# Altium schematic sheet Power_Neg.SchDoc
size A4; DocumentNumber: 3; SheetNumber: 3; SheetTotal: 11
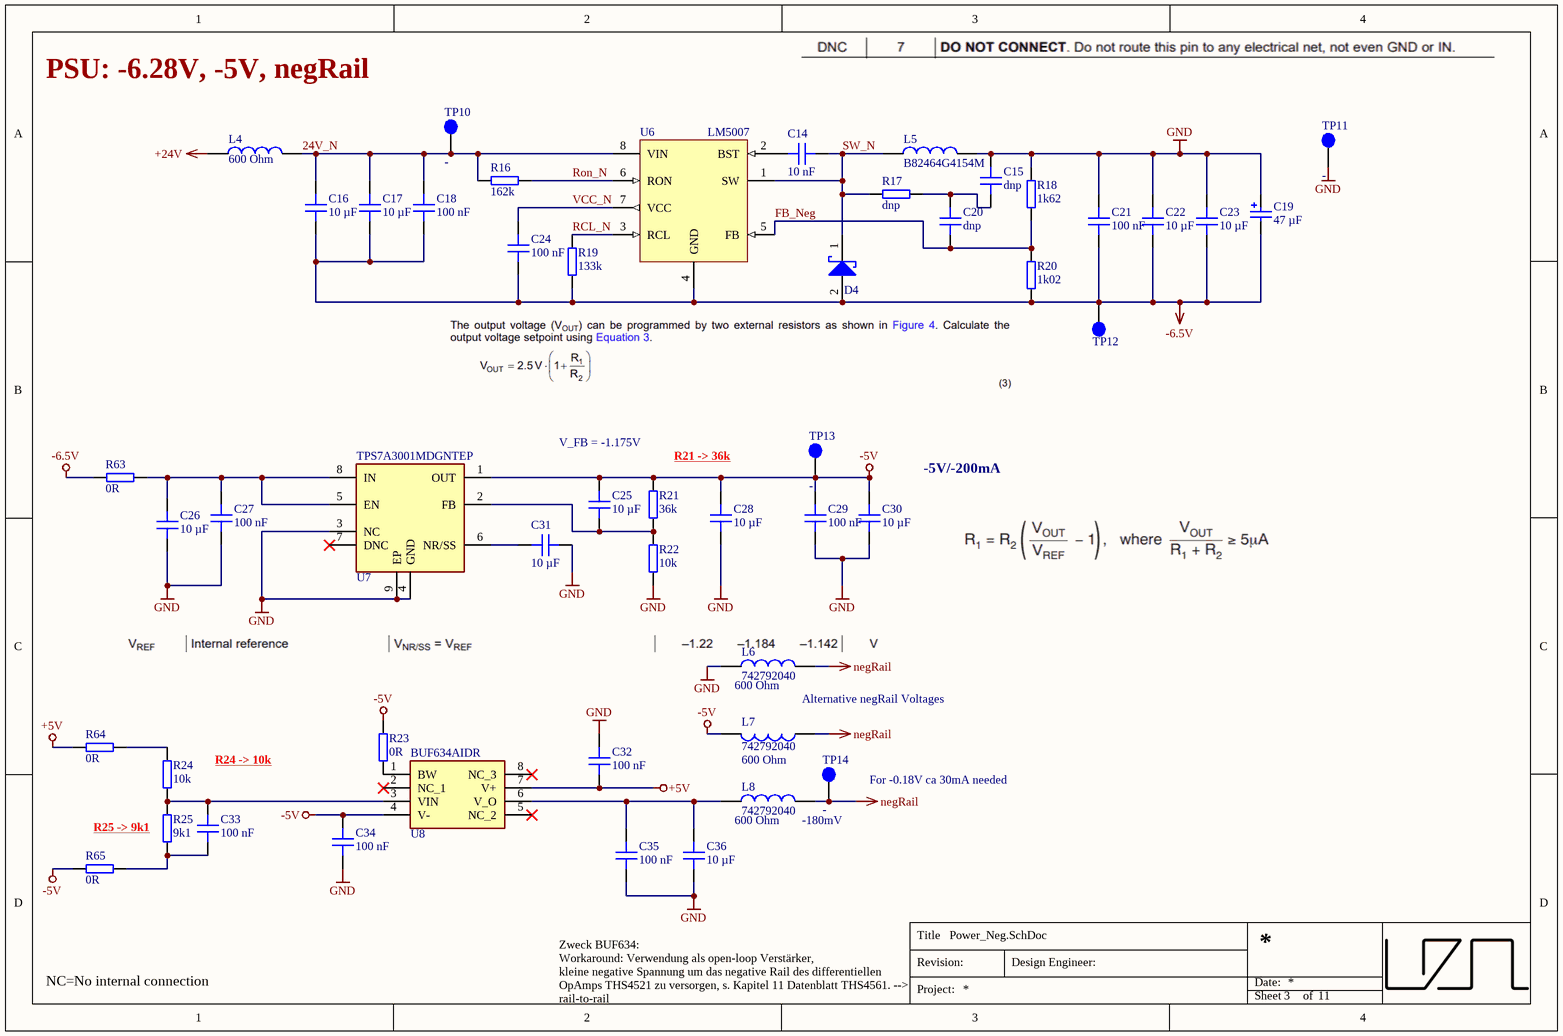
[diagram p0: Power_Neg.SchDoc]

## Parts
C14  10 nF  [C_0603]
C15  dnp  [C_1206]
C16  10 µF  [C_1206]
C17  10 µF  [C_1206]
C18  100 nF  [C_0603]
C19  47 µF  [WCAP-ASLI_5x5.5]
C20  dnp  [C_1206]
C21  100 nF  [C_0603]
C22  10 µF  [C_1206]
C23  10 µF  [C_1206]
C24  100 nF  [C_0603]
C25  10 µF  [C_1206]
C26  10 µF  [C_1206]
C27  100 nF  [C_0603]
C28  10 µF  [C_1206]
C29  100 nF  [C_0603]
C30  10 µF  [C_1206]
C31  10 µF  [C_1206]
C32  100 nF  [C_0603]
C33  100 nF  [C_0603]
C34  100 nF  [C_0603]
C35  100 nF  [C_0603]
C36  10 µF  [C_1206]
D4  BYS12-90-E3/TR3  [DIOM4227X23N]  (value not drawn)
L4  value 600 Ohm  [WE-CBF_0805_High Current]  (hidden comment: 742792040)
L5  B82464G4154M  [SMT_inductor_1050]
L6  742792040  value 600 Ohm  [WE-CBF_0805_High Current]
L7  742792040  value 600 Ohm  [WE-CBF_0805_High Current]
L8  742792040  value 600 Ohm  [WE-CBF_0805_High Current]
R16  162k  [RES 0603_1608]
R17  dnp  [RES 0603_1608]
R18  1k62  [RES 0603_1608]
R19  133k  [RES 0603_1608]
R20  1k02  [RES 0603_1608]
R21  36k  [RES 0603_1608]
R22  10k  [RES 0603_1608]
R23  0R  [RES 0603_1608]
R24  10k  [RES 0603_1608]
R25  9k1  [RES 0603_1608]
R63  0R  [RES 0603_1608]
R64  0R  [RES 0603_1608]
R65  0R  [RES 0603_1608]
TP10  -  [TP_1mm]
TP11  -  [TP_1mm]
TP12  -  [TP_1mm]  (value not drawn)
TP13  -  [TP_1mm]
TP14  -  [TP_1mm]
U6  LM5007MM/NOPB  [TSOP65P490X110-8N]  (value not drawn)
U7  TPS7A3001MDGNTEP  [SOP65P490X110-9N]
U8  BUF634AIDR  [SOIC127P600X175-8N]

## Nets
+5V: C32.1 R64.1 U8.7(V+)
+24V: L4.1
-5V: C25.2 C28.2 C29.2 C30.2 C34.2 L7.2 R21.2 R23.2 R65.1 TP13.1 U7.1(OUT) U8.4(V-)
-6.5V: C16.1 C17.1 C18.1 C19.2(N) C21.1 C22.1 C23.1 C24.1 D4.2(A) R19.1 R20.1 R63.1 TP12.1 U6.4(GND)
GND: C15.2 C19.1(P) C21.2 C22.2 C23.2 C26.1 C27.1 C28.1 C29.1 C30.1 C31.1 C32.2 C34.1 C35.1 C36.1 L5.2 L6.1 R18.2 R22.1 TP11.1 U7.3(NC) U7.4(GND) U7.9(EP)
negRail: L6.2 L7.1 L8.2 TP14.1
24V_N: C16.2 C17.2 C18.2 L4.2 R16.1 TP10.1 U6.8(VIN)
FB_Neg: C20.1 R18.1 R20.2 U6.5(FB)
RCL_N: R19.2 U6.3(RCL)
Ron_N: R16.2 U6.6(RON)
SW_N: C14.2 D4.1(K) L5.1 R17.1 U6.1(SW)
VCC_N: C24.2 U6.7(VCC)
NetC14_1: C14.1 U6.2(BST)
NetC15_1: C15.1 C20.2 R17.2
NetC25_1: C25.1 R21.1 R22.2 U7.2(FB)
NetC26_2: C26.2 C27.2 R63.2 U7.5(EN) U7.8(IN)
NetC31_2: C31.2 U7.6(NR/SS)
NetC33_1: C33.1 R25.1 R65.2
NetC33_2: C33.2 R24.1 R25.2 U8.3(VIN)
NetC35_2: C35.2 C36.2 L8.1 U8.6(V_O)
NetR23_1: R23.1 U8.1(BW)
NetR24_2: R24.2 R64.2

Not connected (* = marked no-connect by the designer): U7 7(DNC)*; U8 2(NC_1)* 5(NC_2)* 8(NC_3)*

## Notes on the sheet
- PSU: -6.28V, -5V, negRail
- V_FB = -1.175V
- R21 -> 36k
- -5V/-200mA
- Alternative negRail Voltages
- R24 -> 10k
- (near TP14) For -0.18V ca 30mA needed
- (near R25) R25 -> 9k1
- (near L8) -180mV
- NC=No internal connection
- Zweck BUF634:
  Workaround: Verwendung als open-loop Verstärker,
  kleine negative Spannung um das negative Rail des differentiellen OpAmps THS4521 zu versorgen, s. Kapitel 11 Datenblatt THS4561. --> rail-to-rail
- Title
- Revision:
- Design Engineer:
- Date:
- Project:
- Sheet
- of

## Library data of the parts
C14 = 885012206065: Capacitor 0603, 25 VDC, 10 nF, X7R; Manufacturer: Wurth Elektronik; Tolerance: 10 %; Voltage Rating: 25 VDC; Created from: MGremer; Manufacturer Part Number: 885012206065; PartID: 53; Created On: 20.12.2020 13:54:13; ComponentLink1Description: Datasheet; ComponentLink1URL: https://www.mouser.de/datasheet/2/445/885012206065-1727544.pdf; Component Type: Capacitor 0603; Device Package: 0603; Last Updated: 20.12.2020 16:43:29; Mounting Type: SMD; Operating Temperature: -55 - 125°C; Series: WCAP-CSGP; Supplier 1: Mouser; Supplier Part Number 1: 710-885012206065; Type: Capacitor; Value: 10 nF; Live Cycle Status: 1; Stock number: not stored
C15 C20 = GRM3195C1H273JA01D: Capacitor 1206, 50 VDC, 0.027 µF, C0G; Manufacturer: Murata Electronics; Tolerance: 5 %; Voltage Rating: 50 VDC; Created from: MGremer; Manufacturer Part Number: GRM3195C1H273JA01D; PartID: 51; Created On: 20.12.2020 13:54:13; ComponentLink1Description: Datasheet; ComponentLink1URL: https://www.mouser.de/datasheet/2/281/murata_03052018_GRM_Series_1-1310166.pdf; Component Type: Capacitor 1206; Device Package: 1206; Last Updated: 18.01.2021 14:28:15; Mounting Type: SMD; Operating Temperature: -55 - 125°C; Series: GRM; Supplier 1: Mouser; Supplier Part Number 1: 81-GRM315C1H273JA01D; Type: Capacitor; Value: 0.027 µF; Live Cycle Status: 1; Stock number: not stored
C16 C17 C22 C23 C25 C26 C28 C30 C31 C36 = GRT31CR61H106KE01L: Capacitor 1206, 50 VDC, 10 µF, X5R; Manufacturer: Murata Electronics; Tolerance: 10 %; Voltage Rating: 50 VDC; Created from: MGremer; Manufacturer Part Number: GRT31CR61H106KE01L; PartID: 65; Created On: 20.12.2020 13:54:13; ComponentLink1Description: Datasheet; ComponentLink1URL: https://www.mouser.de/datasheet/2/281/1/GRT31CR61H106KE01_01-1989724.pdf; Component Type: Capacitor 1206; Device Package: 1206; Last Updated: 20.12.2020 16:34:30; Mounting Type: SMD; Operating Temperature: -55 - 85°C; Series: GRT; Supplier 1: Mouser; Supplier Part Number 1: 81-GRT31CR61H106KE1L; Type: Capacitor; Value: 10 µF; Live Cycle Status: 1; Stock number: Labor SMD Container
C18 C21 C24 C27 C29 C32-C35 = C0603C104K9PACTU: Capacitor 0603, 6.3 VDC, 100 nF, X5R; Manufacturer: KEMET; Tolerance: 10 %; Voltage Rating: 6.3 VDC; Created from: MGremer; Manufacturer Part Number: C0603C104K9PACTU; PartID: 70; Created On: 20.12.2020 13:54:13; ComponentLink1Description: Datasheet; ComponentLink1URL: https://www.mouser.de/datasheet/2/212/KEM_C1006_X5R_SMD-1103249.pdf; Component Type: Capacitor 0603; Device Package: 0603; Last Updated: 20.01.2021 13:57:36; Mounting Type: SMD; Operating Temperature: -55 - 85°C; Series: SMD Comm X5R; Supplier 1: Mouser; Supplier Part Number 1: 80-C0603C104K9P; Type: Capacitor; Value: 100 nF; Live Cycle Status: 1; Stock number: not stored
C19 = 865080242004: Capacitor WCAP, 6.3 VDC, 100 µF; Manufacturer: Wuerth Elektronik; Tolerance: 20 %; Voltage Rating: 10 VDC; Created from: MHlatky; Manufacturer Part Number: 865080242004; PartID: 90; Created On: 20.12.2020 13:54:13; ComponentLink1Description: Datasheet; ComponentLink1URL: https://www.mouser.de/datasheet/2/445/865080242004-1726409.pdf; Component Type: Capacitor WCAP; Device Package: WCAP; Last Updated: 18.01.2021 16:16:48; Mounting Type: SMD; Operating Temperature: -55 - 105°C; Series: WCAP-ASLI; Supplier 1: Mouser; Supplier Part Number 1: 710-865080242004; Type: Capacitor; Value: 47 µF; Live Cycle Status: 1; Stock number: not stored
D4 = BYS12-90-E3/TR3: Schottky Rectifier, 1.5 A, 90 V; Manufacturer: Vishay General Semiconductor; Forward Voltage: 0.75 V; Forward Current: 1.5 A; Reverse Current: 100 µA; Created from: MGremer; Supplier 1: Mouser; Supplier Part Number 1: 625-BYS12-90-E3/TR3; Manufacturer Part Number: BYS12-90-E3/TR3; PartID: 2; Created On: 06.01.2021 14:34:10; ComponentLink1Description: Datasheet; ComponentLink1URL: https://www.mouser.de/datasheet/2/427/bys12_90-1768074.pdf; Component Type: Schottky Rectifier; Device Package: SMA; Last Updated: 18.01.2021 16:09:20; Mounting Type: SMD; Operating Temperature: -55 - 150 °C; Type: Schottky Rectifier; Value: -; Live Cycle Status: 1; Stock number: not stored
L4 L6-L8 = 742792040: Inductance, 0805, 100 MHz, 600 Ohm, 2 A; Manufacturer: Wurth Elektronik; Type: Inductance SMD; DC current: 2 A; Created from: MGremer; Manufacturer Part Number: 742792040; PartID: 1; Created On: 18.01.2021 14:53:17; ComponentLink1Description: Datasheet; ComponentLink1URL: https://www.mouser.de/datasheet/2/445/742792040-1720361.pdf; Component Type: Inductance; Device Package: 0805; Last Updated: 18.01.2021 14:53:25; Mounting Type: SMD; Operating Temperature: -55 - 125 °C; Series: WE-CBF; Supplier 1: Mouser; Supplier Part Number 1: 710-742792040; Live Cycle Status: 1; Stock number: not stored
L5 = B82464G4154M: Inductor SMT, 10 x 10, 150 µH, 0.8 A; Manufacturer: TDK; MF: EPCOS / TDK; Value: 150 µH; DCR: 320m; Rated Current: 0.85 A; DC current: 0.8 A; Created from: MGremer; MPN: B82464G4154M; Supplier 1: Mouser; Supplier Part Number 1: 871-B82464G4154M; Manufacturer Part Number: B82464G4154M; PartID: 5; Created On: 08.06.2021 11:33:39; ComponentLink1Description: Datasheet; ComponentLink1URL: https://www.tdk-electronics.tdk.com/inf/30/db/ind_2008/b82464g4.pdf; Component Type: Inductor; Device Package: 10.4 x 10.4 x 4.8 (mm); Last Updated: 24.08.2021 15:23:28; Mounting Type: SMD; Operating Temperature: -55 - 125 °C; Series: B82464G; Type: Inductor; Live Cycle Status: 1; Stock number: not stored
R16 = CR0603-FX-1623ELF: SMD resistor 1%; Manufacturer: Burns; Created from: MGremer; Manufacturer Part Number: CR0603-FX-1623ELF; PartID: 165; Created On: 14.12.2020 16:17:14; ComponentLink1Description: Datasheet; ComponentLink1URL: https://www.mouser.de/datasheet/2/54/crxxxxx-1858361.pdf; Component Type: SMD resistor; Device Package: 0603; Last Updated: 02.03.2021 14:07:32; Mounting Type: SMD; Supplier 1: Mouser; Supplier Part Number 1: 652-CR0603-FX1623ELF; Type: Resistor; Tolerance: 1%; Value: 162k; Live Cycle Status: 1; Stock number: not stored
R17 = -: SMD resistor E24 series; Created from: MGremer; Manufacturer Part Number: -; PartID: 147; Created On: 14.12.2020 16:17:14; ComponentLink1Description: Datasheet; ComponentLink1URL: -; Component Type: SMD resistor; Device Package: 0603; Last Updated: 02.03.2021 14:07:32; Manufacturer: -; Mounting Type: SMD; Supplier 1: -; Supplier Part Number 1: -; Type: Resistor; Tolerance: -; Value: dnp; Live Cycle Status: 1; Stock number: Labor SMD Container
R18 = ERJ-P03F1621V: SMD resistor 1%; Manufacturer: Panasonic; Created from: MGremer; Manufacturer Part Number: ERJ-P03F1621V; PartID: 191; Created On: 14.12.2020 16:17:14; ComponentLink1Description: Datasheet; ComponentLink1URL: https://www.mouser.de/datasheet/2/315/AOA0000C331-1141874.pdf; Component Type: SMD resistor; Device Package: 0603; Last Updated: 02.07.2021 11:49:34; Mounting Type: SMD; Supplier 1: Mouser; Supplier Part Number 1: 667-ERJ-P03F1621V; Type: Resistor; Tolerance: 1%; Value: 1k62; Live Cycle Status: 1; Stock number: not stored
R19 = CR0603-FX-1333ELF: SMD resistor 1%; Manufacturer: Burns; Created from: MGremer; Manufacturer Part Number: CR0603-FX-1333ELF; PartID: 166; Created On: 14.12.2020 16:17:14; ComponentLink1Description: Datasheet; ComponentLink1URL: https://www.mouser.de/datasheet/2/54/crxxxxx-1858361.pdf; Component Type: SMD resistor; Device Package: 0603; Last Updated: 02.03.2021 14:07:32; Mounting Type: SMD; Supplier 1: Mouser; Supplier Part Number 1: 652-CR0603FX-1333ELF; Type: Resistor; Tolerance: 1%; Value: 133k; Live Cycle Status: 1; Stock number: not stored
R20 = CR0603-FX-1021ELF: SMD resistor 1%; Manufacturer: Burns; Created from: MGremer; Manufacturer Part Number: CR0603-FX-1021ELF; PartID: 168; Created On: 14.12.2020 16:17:14; ComponentLink1Description: Datasheet; ComponentLink1URL: https://www.mouser.de/datasheet/2/54/crxxxxx-1858361.pdf; Component Type: SMD resistor; Device Package: 0603; Last Updated: 02.03.2021 14:07:32; Mounting Type: SMD; Supplier 1: Mouser; Supplier Part Number 1: 652-CR0603FX-1021ELF; Type: Resistor; Tolerance: 1%; Value: 1k02; Live Cycle Status: 1; Stock number: not stored
R21 = RK73H1ETTP3602F: SMD resistor 1%; Manufacturer: KOA Speer; Created from: MHoerner; Manufacturer Part Number: RK73H1ETTP3602F; PartID: 302; Created On: 07.11.2023 16:01:42; ComponentLink1Description: Datasheet; ComponentLink1URL: https://www.koaspeer.com/pdfs/RK73H.pdf; Component Type: SMD resistor; Device Package: 0603; Last Updated: 07.11.2023 16:03:21; Mounting Type: SMD; Supplier 1: Mouser; Supplier Part Number 1: 660-RK73H1ETTP3602F; Type: Resistor; Tolerance: 1%; Value: 36k; Live Cycle Status: 1; Stock number: not stored; LCSC Part Number: C114619
R22 R24 = RK73B1JTTD103J: SMD resistor E24 series; Manufacturer: KOA Speer; Tolerance: 5%; Created from: MGremer; Manufacturer Part Number: RK73B1JTTD103J; PartID: 98; Created On: 14.12.2020 16:17:14; ComponentLink1Description: Datasheet; ComponentLink1URL: https://www.mouser.de/datasheet/2/219/RK73B-1825463.pdf; Component Type: SMD resistor; Device Package: 0603; Mounting Type: SMD; Supplier 1: Mouser; Supplier Part Number 1: 660-RK73B1JTTD103J; Type: Resistor; Value: 10k; Live Cycle Status: 1; Stock number: Labor SMD Container
  R22: Last Updated: 02.03.2021 14:07:32
  R24: Last Updated: 27.05.2022 14:04:22; LCSC Part Number: C25804
R23 R63-R65 = RC0603JR-070RL: SMD resistor E24 series; Manufacturer: YAGEO; Tolerance: 5%; Created from: MGremer; Manufacturer Part Number: RC0603JR-070RL; PartID: 1; Created On: 14.12.2020 16:17:14; ComponentLink1Description: Datasheet; ComponentLink1URL: https://www.mouser.de/datasheet/2/447/PYu-RC_Group_51_RoHS_L_10-1664068.pdf; Component Type: SMD resistor; Device Package: 0603; Last Updated: 04.03.2021 09:09:42; Mounting Type: SMD; Supplier 1: Mouser; Supplier Part Number 1: 603-RC0603JR-070RL; Supplier 2: LCSC; Supplier Part Number 2: C21189; Type: Resistor; Value: 0R; Live Cycle Status: 1; Stock number: Labor SMD Container; LCSC Part Number: C21189
R25 = SG73S1JTTD9101F: SMD resistor 1%; Manufacturer: KOA Speer; Created from: MHoerner; Manufacturer Part Number: SG73S1JTTD9101F; PartID: 301; Created On: 07.11.2023 16:01:42; ComponentLink1Description: Datasheet; ComponentLink1URL: https://www.koaspeer.com/pdfs/SG73S.pdf; Component Type: SMD resistor; Device Package: 0603; Last Updated: 07.11.2023 16:06:58; Mounting Type: SMD; Supplier 1: Mouser; Supplier Part Number 1: 660-SG73S1JTTD9101F; Type: Resistor; Tolerance: 1%; Value: 9k1; Live Cycle Status: 1; Stock number: not stored; LCSC Part Number: C23260
TP10-TP14 = -: Test Point 1 mm; Value: TP; Created from: MGremer; Created: 2018_06_25_AGeiger; Manufacturer Part Number: -; PartID: 9; Created On: 02.03.2021 14:59:37; ComponentLink1Description: Datasheet; ComponentLink1URL: -; ComponentLink2Description: Homepage; ComponentLink2URL: -; Component Type: Test Point; Device Package: SMD; Last Updated: 03.11.2021 09:04:23; Manufacturer: -; Minimum Order: 1; Mounting Type: SMD; Supplier 1: -; Supplier Part Number 1: -; Type: Test point; Live Cycle Status: 1; Stock number: not stored
U6 = LM5007MM/NOPB: LM5007 75-V, 0.5-A DC/DC Buck Converter With 80-V Integrated Power MOSFET; Manufacturer: TI; MF: Texas Instruments; Created from: MHlatky; MPN: LM5007MM/NOPB; Supplier 1: Mouser; Supplier 2: Mouser; Supplier 3: Digi-Key; Supplier Part Number 1: 926-LM5007MM/NOPB; Supplier Part Number 2: 926-LM5007MM/NOPB; Supplier Part Number 3: LM5007MM/NOPBCT-ND; Package: VSSOP-8; Manufacturer Part Number: LM5007MM/NOPB; PartID: 14; Created On: 03.03.2022 16:53:36; ComponentLink1Description: Datasheet; ComponentLink1URL: https://www.ti.com/lit/ds/symlink/lm5007.pdf?ts=1616234834930&ref_url=https%253A%252F%252Fwww.google.ru%252F; Component Type: LM5007; Last Updated: 08.03.2022 11:31:47; Mounting Type: TSOP; Operating Temperature: -40 - 125; Type: Buck Converter; Live Cycle Status: 1
U7 = TPS7A3001MDGNTEP: –36V, –200mA, ULTRALOW-NOISE, NEGATIVE LINEAR REGULATOR; Manufacturer_Name: Texas Instruments; Manufacturer: TI; Created from: MHlatky; Datasheet Link: http://www.ti.com/lit/gpn/tps7a3001-ep; Height: 1.1mm; Mouser2 Part Number: 595-TPS7A3001MDGNTEP; Mouser2 Price/Stock: https://www.mouser.com/Search/Refine.aspx?Keyword=595-TPS7A3001MDGNTEP; Manufacturer_Part_Number: TPS7A3001MDGNTEP; Manufacturer Part Number: TPS7A3001MDGNTEP; PartID: 11; Created On: 03.03.2022 16:53:36; ComponentLink1Description: Datasheet; ComponentLink1URL: https://www.ti.com/lit/ds/symlink/ths4521.pdf?HQS=dis-mous-null-mousermode-dsf-pf-null-wwe&ts=1646514637932&ref_url=https%253A%252F%252Fwww.mouser.de%252F; Component Type: TPS7A3001MDGNTEP; Last Updated: 08.03.2022 11:07:28; Mounting Type: SOP; Operating Temperature: -55 - 125; Supplier 1: Mouser; Supplier Part Number 1: 595-TPS7A3001MDGNTEP; Type: Negative Line Regulator; Live Cycle Status: 1
U8 = BUF634AIDR: 36-V, 210-MHz, 250-mA Output, High-Speed Buffer; Manufacturer_Name: Texas Instruments; Manufacturer: TI; Created from: MHlatky; Datasheet Link: http://www.ti.com/lit/gpn/BUF634A; Height: 1.75mm; Mouser2 Part Number: 595-BUF634AIDR; Mouser2 Price/Stock: https://www.mouser.com/Search/Refine.aspx?Keyword=595-BUF634AIDR; Manufacturer_Part_Number: BUF634AIDR; Manufacturer Part Number: BUF634AIDR; PartID: 1; Created On: 03.03.2022 16:53:36; ComponentLink1Description: Datasheet; ComponentLink1URL: https://www.ti.com/lit/ds/symlink/buf634a.pdf?HQS=dis-mous-null-mousermode-dsf-pf-null-wwe&ts=1646325847425&ref_url=https%253A%252F%252Fwww.mouser.de%252F; Component Type: BUF634A; Last Updated: 05.03.2022 21:08:20; Mounting Type: SOIC; Operating Temperature: -40 - 125; Supplier 1: Mouser; Supplier Part Number 1: 595-BUF634AIDR; Type: OpAmp; Live Cycle Status: 1